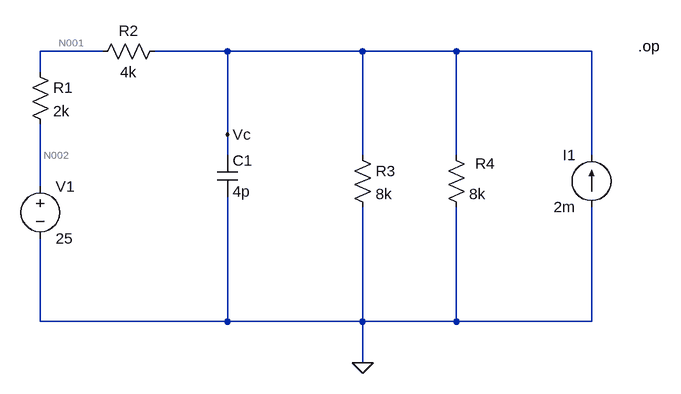
[diagram p0: schematic fermé.asc]
fermé.asc, the LTspice schematic file:
Version 4
SHEET 1 1728 680
WIRE -128 -64 -224 -64
WIRE 64 -64 -48 -64
WIRE 272 -64 64 -64
WIRE 416 -64 272 -64
WIRE 624 -64 416 -64
WIRE -224 -32 -224 -64
WIRE 64 64 64 -64
WIRE 64 96 64 64
WIRE 272 96 272 -64
WIRE 416 96 416 -64
WIRE 624 96 624 -64
WIRE -224 144 -224 48
WIRE -224 352 -224 224
WIRE 64 352 64 160
WIRE 64 352 -224 352
WIRE 272 352 272 176
WIRE 272 352 64 352
WIRE 416 352 416 176
WIRE 416 352 272 352
WIRE 624 352 624 176
WIRE 624 352 416 352
WIRE 272 416 272 352
FLAG 272 416 0
FLAG 64 64 Vc
SYMBOL voltage -224 128 R0
SYMATTR InstName V1
SYMATTR Value 25
SYMBOL res -240 -48 R0
SYMATTR InstName R1
SYMATTR Value 2k
SYMBOL res -32 -80 R90
WINDOW 0 0 56 VBottom 2
WINDOW 3 32 56 VTop 2
SYMATTR InstName R2
SYMATTR Value 4k
SYMBOL res 256 80 R0
SYMATTR InstName R3
SYMATTR Value 8k
SYMBOL res 400 80 R0
WINDOW 0 45 29 Left 2
SYMATTR InstName R4
SYMATTR Value 8k
SYMBOL current 624 176 R180
WINDOW 0 24 80 Left 2
WINDOW 3 24 0 Left 2
WINDOW 123 0 0 Left 0
WINDOW 39 0 0 Left 0
SYMATTR InstName I1
SYMATTR Value 2m
SYMBOL cap 48 96 R0
SYMATTR InstName C1
SYMATTR Value 4p
TEXT 696 -72 Left 2 !.op

The netlist it stands for:
* fermé.asc
V1 N002 0 25
R1 N001 N002 2k
R2 Vc N001 4k
R3 Vc 0 8k
R4 Vc 0 8k
I1 0 Vc 2m
C1 Vc 0 4p
.op
.backanno
.end

* Results of the author's LTspice run, read from the files saved beside the schematic
* Operating Point:
*   V(n002) = 25 V
*   V(n001) = 21.6 V
*   V(vc) = 14.8 V
*   I(C1) = 0 A
*   I(I1) = 2 mA
*   I(R4) = 1.85 mA
*   I(R3) = 1.85 mA
*   I(R2) = -1.7 mA
*   I(R1) = -1.7 mA
*   I(V1) = -1.7 mA